# Altium schematic sheet Kasli-SOC_bank35.SchDoc: FASEC
size 420 x 297 mm; CheckedBy: B. Recordon; CompanyName: CERN; DrawnBy: PVT; Organization: CERN; Address1: European Organization for Nuclear Research; Address2: CH-1211 Genève 23 - Switzerland; Revision: 0.9; SheetNumber: 5; SheetTotal: 18; EDA_Number: EDA-03288-V3-0; Projet: FPGA & ARM SoC FMC Carrier; ModifiedBy: P. Van Trappen; CreateDate: 14/12/2015; CheckedDate: 08/08/2018; Title2: Zynq SoC - Bank 35; DivGrp: TE/ABT; Designer: P. Van Trappen
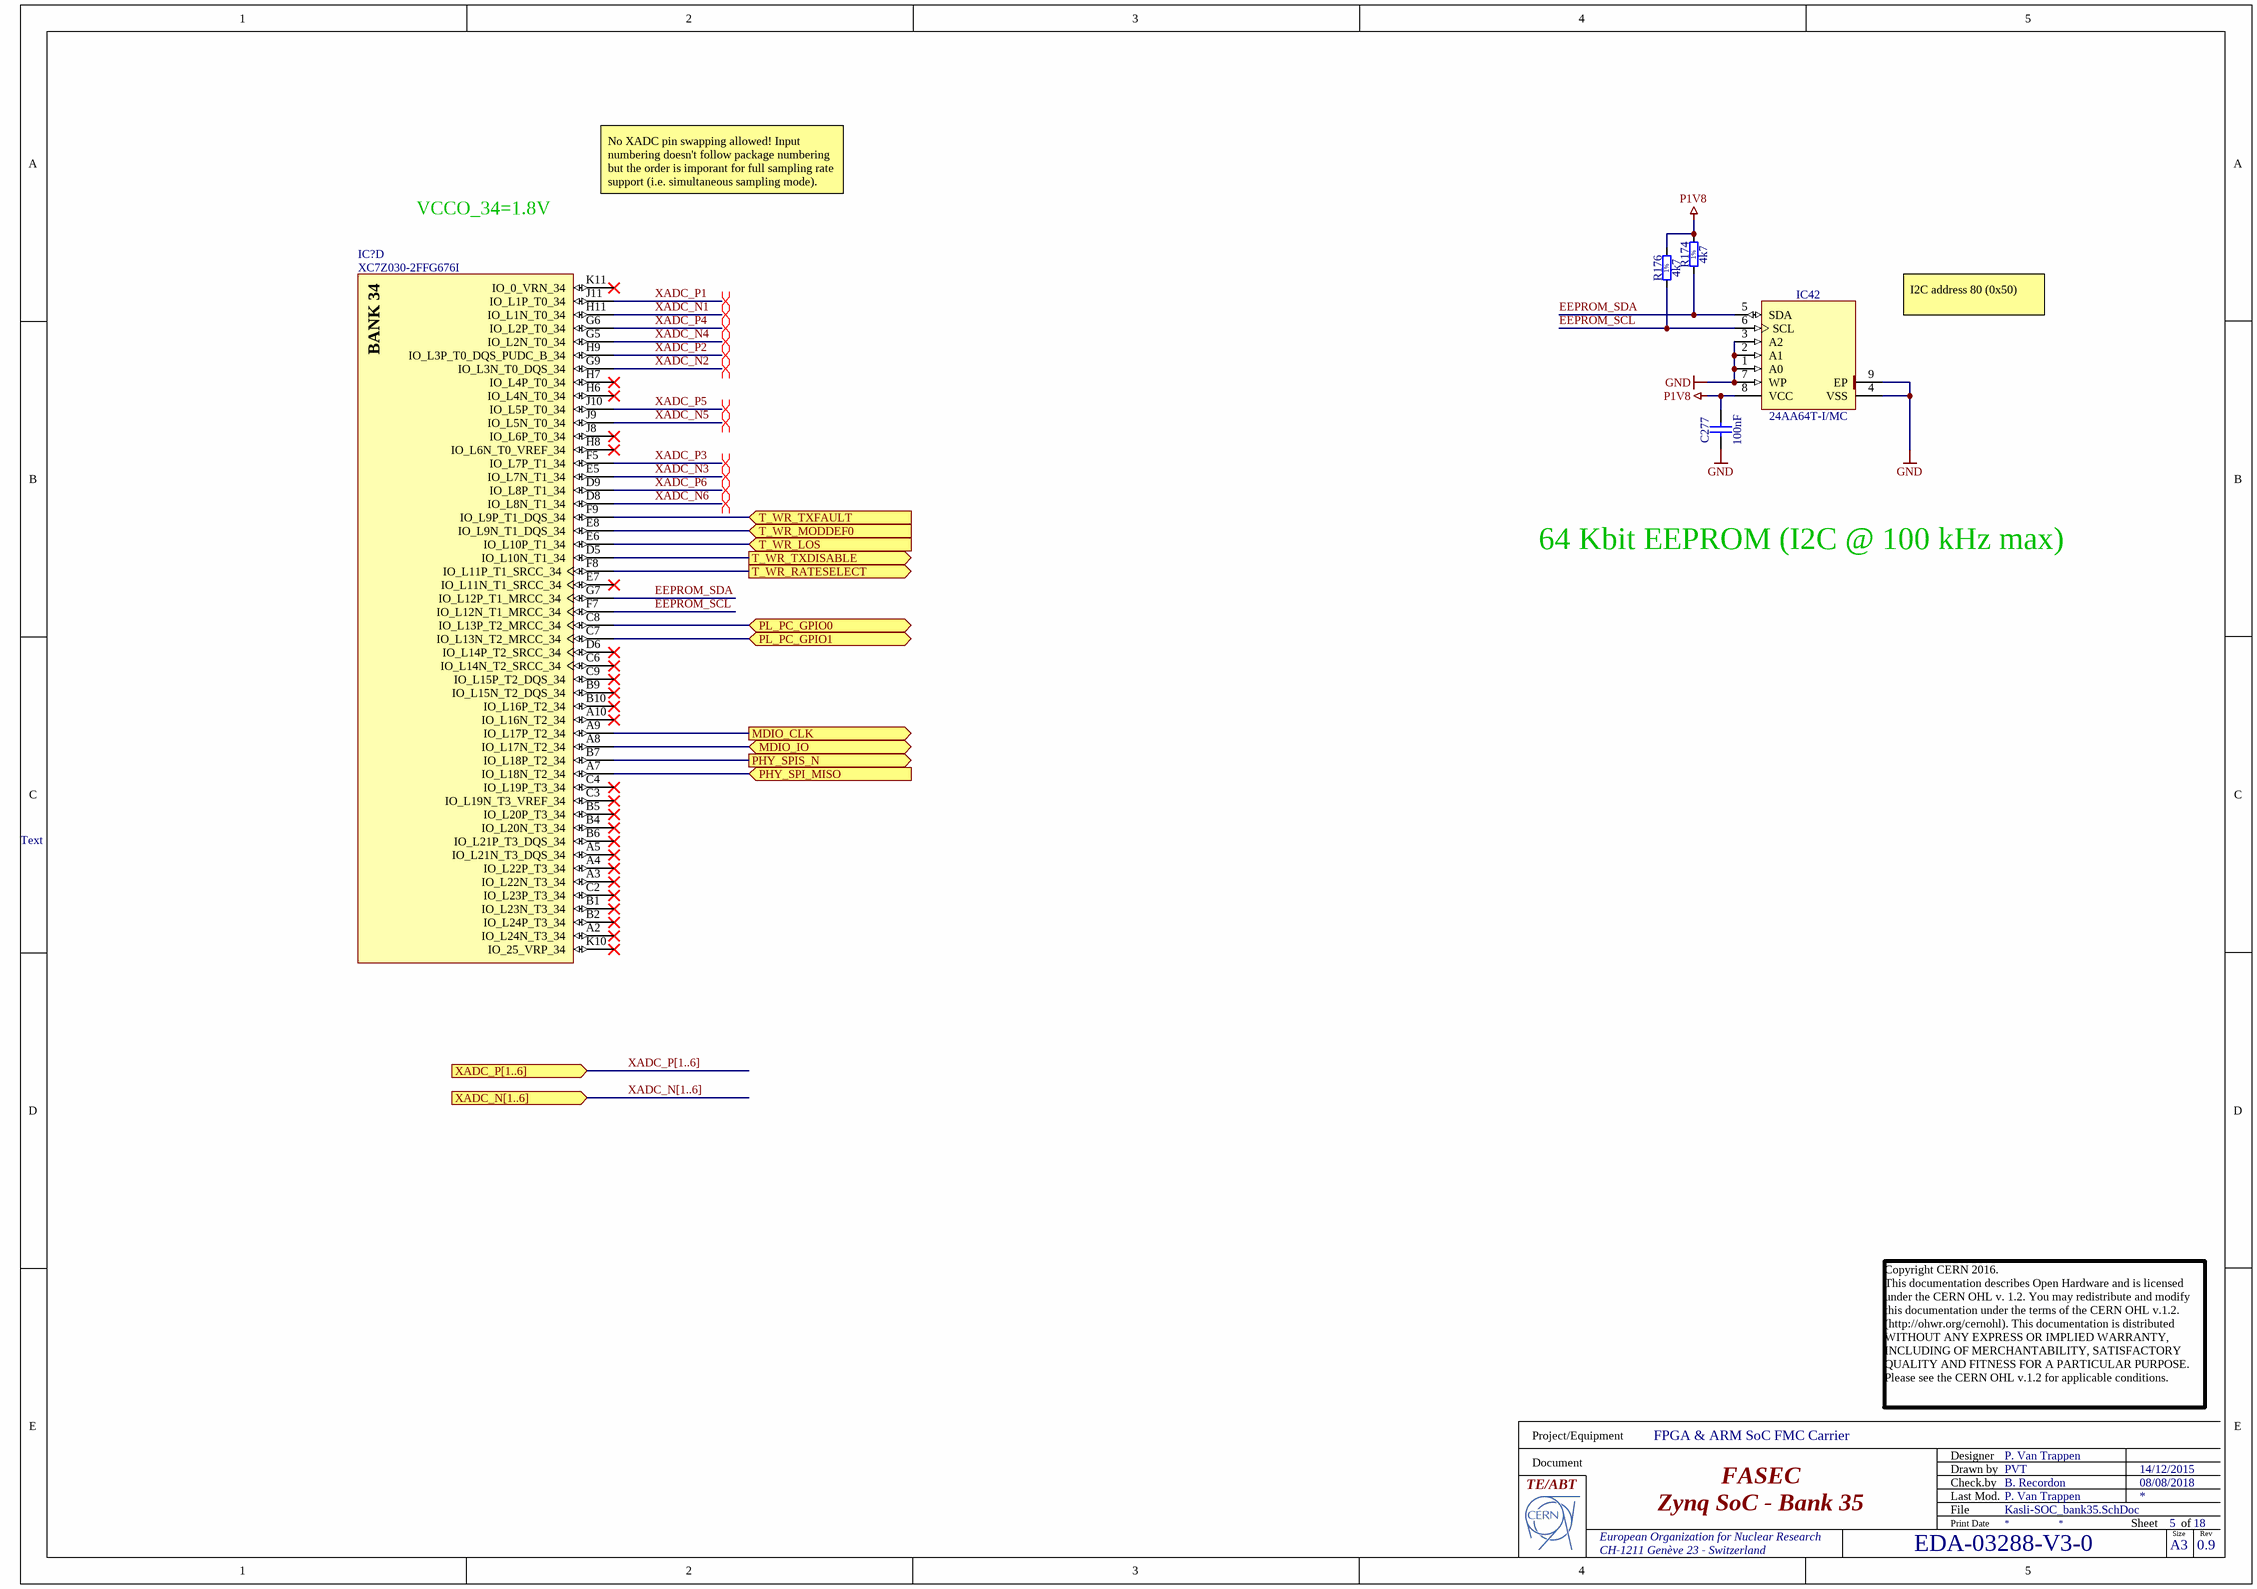
[diagram p0: Kasli-SOC_bank35.SchDoc]

## Parts
C277  100nF  [CAPC1005X55N]
IC42  24AA64T-I/MC  [SON50P300X200X100-9N-R175X155]
IC?  XC7Z030-2FFG676I  [BGA676C100P26X26_2700X2700X324]  (part D of 14)
R174  4k7  [RESC2012X60N]
R176  4k7  [RESC2012X60N]

## Ports
MDIO_CLK (out), MDIO_IO (bidir), PHY_SPI_MISO (in), PHY_SPIS_N (out), PL_PC_GPIO0 (bidir), PL_PC_GPIO1 (bidir), T_WR_LOS (in), T_WR_MODDEF0 (in), T_WR_RATESELECT (out), T_WR_TXDISABLE (out), T_WR_TXFAULT (in), XADC_N[1..6] (in), XADC_P[1..6] (in)

## Nets
GND: C277.1 IC42.1(A0) IC42.2(A1) IC42.3(A2) IC42.4(VSS) IC42.7(WP) IC42.9(EP)
P1V8: C277.2 IC42.8(VCC) R174.2 R176.2
EEPROM_SCL: IC42.6(SCL) IC?.F7(IO_L12N_T1_MRCC_34) R176.1
EEPROM_SDA: IC42.5(SDA) IC?.G7(IO_L12P_T1_MRCC_34) R174.1
MDIO_CLK: IC?.A9(IO_L17P_T2_34) ; port MDIO_CLK
MDIO_IO: IC?.A8(IO_L17N_T2_34) ; port MDIO_IO
PHY_SPI_MISO: IC?.A7(IO_L18N_T2_34) ; port PHY_SPI_MISO
PHY_SPIS_N: IC?.B7(IO_L18P_T2_34) ; port PHY_SPIS_N
PL_PC_GPIO0: IC?.C8(IO_L13P_T2_MRCC_34) ; port PL_PC_GPIO0
PL_PC_GPIO1: IC?.C7(IO_L13N_T2_MRCC_34) ; port PL_PC_GPIO1
T_WR_LOS: IC?.E6(IO_L10P_T1_34) ; port T_WR_LOS
T_WR_MODDEF0: IC?.E8(IO_L9N_T1_DQS_34) ; port T_WR_MODDEF0
T_WR_RATESELECT: IC?.F8(IO_L11P_T1_SRCC_34) ; port T_WR_RATESELECT
T_WR_TXDISABLE: IC?.D5(IO_L10N_T1_34) ; port T_WR_TXDISABLE
T_WR_TXFAULT: IC?.F9(IO_L9P_T1_DQS_34) ; port T_WR_TXFAULT
XADC_N1: IC?.H11(IO_L1N_T0_34)
XADC_N2: IC?.G9(IO_L3N_T0_DQS_34)
XADC_N3: IC?.E5(IO_L7N_T1_34)
XADC_N4: IC?.G5(IO_L2N_T0_34)
XADC_N5: IC?.J9(IO_L5N_T0_34)
XADC_N6: IC?.D8(IO_L8N_T1_34)
XADC_P1: IC?.J11(IO_L1P_T0_34)
XADC_P2: IC?.H9(IO_L3P_T0_DQS_PUDC_B_34)
XADC_P3: IC?.F5(IO_L7P_T1_34)
XADC_P4: IC?.G6(IO_L2P_T0_34)
XADC_P5: IC?.J10(IO_L5P_T0_34)
XADC_P6: IC?.D9(IO_L8P_T1_34)

Not connected (* = marked no-connect by the designer): IC? A2(IO_L24N_T3_34)* A3(IO_L22N_T3_34)* A4(IO_L22P_T3_34)* A5(IO_L21N_T3_DQS_34)* A10(IO_L16N_T2_34)* B1(IO_L23N_T3_34)* B2(IO_L24P_T3_34)* B4(IO_L20N_T3_34)* B5(IO_L20P_T3_34)* B6(IO_L21P_T3_DQS_34)* B9(IO_L15N_T2_DQS_34)* B10(IO_L16P_T2_34)* C2(IO_L23P_T3_34)* C3(IO_L19N_T3_VREF_34)* C4(IO_L19P_T3_34)* C6(IO_L14N_T2_SRCC_34)* C9(IO_L15P_T2_DQS_34)* D6(IO_L14P_T2_SRCC_34)* E7(IO_L11N_T1_SRCC_34)* H6(IO_L4N_T0_34)* H7(IO_L4P_T0_34)* H8(IO_L6N_T0_VREF_34)* J8(IO_L6P_T0_34)* K10(IO_25_VRP_34)* K11(IO_0_VRN_34)*

## Buses and harness runs
bus XADC_N[1..6] = port XADC_N[1..6]
bus XADC_P[1..6] = port XADC_P[1..6]

## Layout directives
differential pair: XADC_N1, XADC_N2, XADC_N3, XADC_N4, XADC_N5, XADC_N6, XADC_P1, XADC_P2, XADC_P3, XADC_P4, XADC_P5, XADC_P6

## Notes on the sheet
- No XADC pin swapping allowed! Input numbering doesn't follow package numbering but the order is imporant for full sampling rate support (i.e. simultaneous sampling mode).
- VCCO_34=1.8V
- (near IC42) I2C address 80 (0x50)
- 64 Kbit EEPROM (I2C @ 100 kHz max)
- Text
- Copyright CERN 2016.
  This documentation describes Open Hardware and is licensed under the CERN OHL v. 1.2. You may redistribute and modify this documentation under the terms of the CERN OHL v.1.2. (http://ohwr.org/cernohl). This documentation is distributed WITHOUT ANY EXPRESS OR IMPLIED WARRANTY, INCLUDING OF MERCHANTABILITY, SATISFACTORY QUALITY AND FITNESS FOR A PARTICULAR PURPOSE.
  Please see the CERN OHL v.1.2 for applicable conditions.
- Project/Equipment
- Document
- Designer
- Drawn by
- Check.by
- File
- Last Mod.
- Print Date
- Sheet
- Size
- A3
- of
- Rev
- (in symbol R0805_4K7_1%_0.125W_100PPM) 1%
- (in symbol XC7Z030-2FFG676I, part D) BANK 34

## Library data of the parts
C277 = CC0402_100NF_16V_10%_X7R: Non-polarised capacitor; Part Description: SMD Multilayer Chip Ceramic Capacitor; Manufacturer: GENERIC; Manufacturer1 Part Number: GRM155R71C104KA88D; Voltage: 16V; TC: X7R; Tolerance: ±10%; Part Number: CC0402_100NF_16V_10%_X7R; Component Kind: Standard; Component Type: Standard; Pin Count: 2; Value: 100nF; Status: Not Recommended; Manufacturer Part Number: CC0402_100NF_16V_10%_X7R; Case: 0402; Mounted: Yes; Socket: No; SMD: Yes; Sense: No; Manufacturer1 Example: MURATA; Manufacturer1 ComponentHeight: 0.55mm; HelpURL: \\cern.ch\dfs\Applications\Altium\Datasheets\CC0402_X7R_MURATA_GRM.pdf; Author: CERN DEM JLC; CreateDate: 05/12/2013; LatestRevisionDate: 03/12/2007
IC42 = 24AA64T-I/MC: 1.7-5.5V 64K I2C Serial EEPROM; Part Description: 1.7V-5.5V, 64K  (8K x 8-bit) I2C Serial EEPROM; Manufacturer: MICROCHIP TECHNOLOGY; PressFit: No; Bonding: No; Part Number: 24AA64T-I/MC; Component Kind: Standard; Component Type: Standard; Device: 24AA64T-I/MC; PackageDescription: SON (DFN), 0.50mm pitch, 8 pin, 2mm X 3mm X 1.00mm H body (w/thermal tab 1.75 X 1.55mm),  IPC Medium Density; Manufacturer Part Number: 24AA64T-I/MC; Pin Count: 9; Case: DFN8; Mounted: Yes; Socket: No; SMD: Yes; Sense: No; ComponentHeight: 1mm; HelpURL: \\cern.ch\dfs\Applications\Altium\Datasheets\24AA64T-I-MC.pdf; Author: CERN DEM JLC; CreateDate: 18/11/2009; LatestRevisionDate: 24/01/2011
IC? = XC7Z030-2FFG676I: 733 MHz Zynq™-7000 AP SoC, 130 PS I/O, 254 FPGA I/O, 676-Ball BGA, Speed Grade 2, Industrial Grade, Pb-Free; Part Description: Zynq™-7000 All Programmable SoC, Dual-core ARM® Cortex™-A9 CPU, 676-Ball BGA, Speed Grade 2, Industrial Grade, Pb-Free; Manufacturer: XILINX; PressFit: No; Bonding: No; Part Number: XC7Z030-2FFG676I; Component Kind: Standard; Component Type: Standard; Device: XC7Z030-2FFG676I; PackageDescription: BGA, 1.00mm Pitch, Square; 676 Pin, 26 Columns X 26 Rows, 27.00mm X 27.00mm X 2.60mm H; Manufacturer Part Number: XC7Z030-2FFG676I; Pin Count: 676; Case: BGA676; Mounted: Yes; Socket: No; SMD: Yes; Sense: No; ComponentHeight: 3.24mm; HelpURL: \\cern.ch\dfs\Applications\Altium\Datasheets\XC7Z030-2FFG676I.pdf; ComponentLink1URL: \\cern.ch\dfs\Applications\Altium\Datasheets\XC7Z030-2FFG676I_Package.pdf; ComponentLink1Description: Package; ComponentLink2URL: \\cern.ch\dfs\Applications\Altium\Datasheets\XC7Z030-2FFG676I_Pinout.txt; ComponentLink2Description: Pinout; Author: CERN DEM JLC; CreateDate: 29/04/2014; LatestRevisionDate: 29/04/2014
R174 R176 = R0805_4K7_1%_0.125W_100PPM: Resistor - 1%; Part Description: General Purpose Thick Film Chip Resistor; Manufacturer: GENERIC; Manufacturer1 Part Number: NRC10F4701TRF; Power: 0.125W; TC: ±100ppm/°C; PressFit: No; Part Number: R0805_4K7_1%_0.125W_100PPM; Component Kind: Standard; Component Type: Standard; Pin Count: 2; Value: 4k7; Status: Preferred; Tolerance: ±1%; Manufacturer Part Number: R0805_4K7_1%_0.125W_100PPM; Case: 0805; Mounted: Yes; Sense: No; Socket: No; SMD: Yes; Manufacturer1 Example: NIC COMPONENT; Manufacturer1 ComponentHeight: 0.6mm; HelpURL: \\cern.ch\dfs\Applications\Altium\Datasheets\R0805_NIC_NRC.pdf; Author: CERN DEM JLC; CreateDate: 03/12/2007; LatestRevisionDate: 13/03/2008